# Altium project H_bridge_circut.PrjPcb
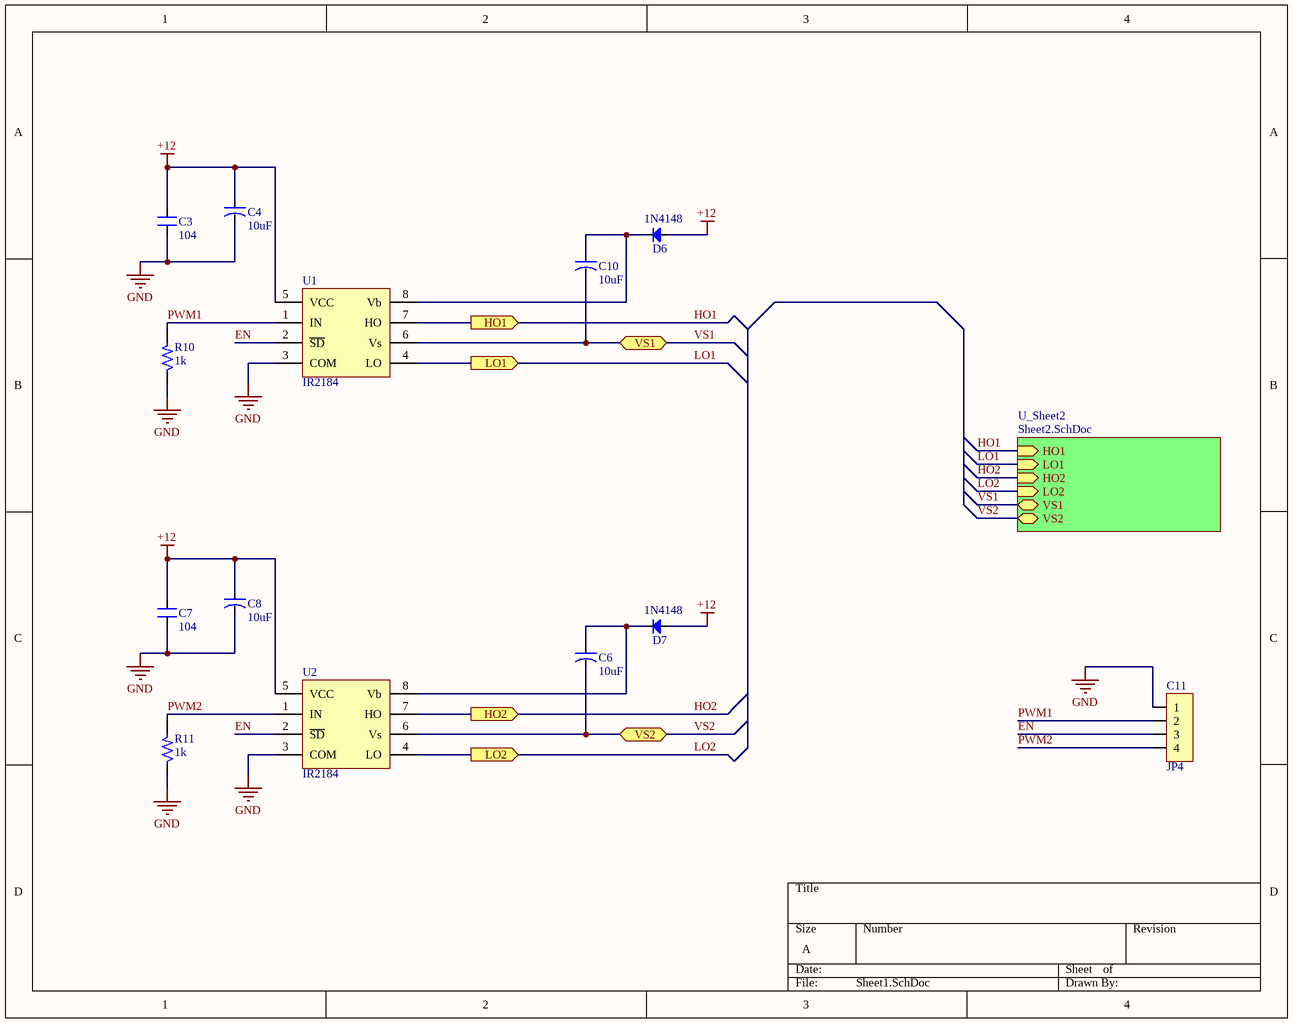
[diagram p0: Sheet1.SchDoc]
2 sheets, 40 parts. Net scope: hierarchical (ports join the sheet entries above them; power ports are global).
Board file: PCB1.PcbDoc
Sheets:
  Sheet1.SchDoc
    U_Sheet2 = Sheet2.SchDoc

## Sheet Sheet1.SchDoc
size A

### Parts
C3  104  [SM-CAP-0805]
C4  10uF  [CAP-ALU-SMD-4.5x5x1.4]
C6  10uF  [CAP-ALU-SMD-4.5x5x1.4]
C7  104  [SM-CAP-0805]
C8  10uF  [CAP-ALU-SMD-4.5x5x1.4]
C10  10uF  [CAP-ALU-SMD-4.5x5x1.4]
C11  JP4  [JP4-C1T]
D6  1N4148  [DIO-SMD-106]
D7  1N4148  [DIO-SMD-106]
R10  1k  [SM-RES-1206]
R11  1k  [SM-RES-1206]
U1  IR2184  [SO8]
U2  IR2184  [SO8]

### Sub-sheets
U_Sheet2 = Sheet2.SchDoc: HO1 (in), LO1 (in), HO2 (in), LO2 (in), VS1 (bidir), VS2 (bidir)

### Ports
HO1 (out), HO2 (out), LO1 (out), LO2 (out), VS1 (bidir), VS2 (bidir)

### Nets
+12: C3.2 C4.1 C7.2 C8.1 D6.1(A) D7.1(A) U1.5(VCC) U2.5(VCC)
GND: C3.1 C4.2 C7.1 C8.2 C11.1 R10.1 R11.1 U1.3(COM) U2.3(COM)
EN: C11.3 U1.2(~{SD}) U2.2(~{SD})
HO1: U1.7(HO) ; port HO1, sheet U_Sheet2/HO1
HO2: U2.7(HO) ; port HO2, sheet U_Sheet2/HO2
LO1: U1.4(LO) ; port LO1, sheet U_Sheet2/LO1
LO2: U2.4(LO) ; port LO2, sheet U_Sheet2/LO2
PWM1: C11.2 R10.2 U1.1(IN)
PWM2: C11.4 R11.2 U2.1(IN)
VS1: C10.2 U1.6(Vs) ; port VS1, sheet U_Sheet2/VS1
VS2: C6.2 U2.6(Vs) ; port VS2, sheet U_Sheet2/VS2
NetC6_1: C6.1 D7.2(K) U2.8(Vb)
NetC10_1: C10.1 D6.2(K) U1.8(Vb)

### Library data of the parts
C3 C7 = CN: Value: 0,1uF/300V; Designed by: VanDungEvn
C4 C6 C8 C10 = CN-ALU-SMD: Polarized Capacitor (Axial); Published: 8-Jun-2000; LatestRevisionDate: 17-Jul-2002; LatestRevisionNote: Re-released for DXP Platform.; PackageReference: POLAR0.8; Publisher: Altium Limited
C11 = JP4: WR-PHD 2.54 mm Angled Socket Header; Manufacturer: W¨¹rth Elektronik eiSos GmbH; partNo: 613004143121; ComponentLink1 Description: Manufacturer; ComponentLink2 Description: Datasheet; NoPins: 04; Created Date: 29 March 2013; ComponentLink1URL: http://www.we-online.com; ComponentLink2URL: http://katalog.we-online.de/em/datasheet/6130xx143121.pdf; Created by: Karrer Zheng
D6 D7 = Diode SMD: Default Diode; Code - JEDEC: DO-214-AB; Value: 1N5007; Published: 8-Jun-2000; Revision: July-2002: Re-released for DXP Platform.; Publisher: Altium Limited
R10 R11 = R: Resistor 1/4W; Value: R1/4W - 1K
U1 U2 = IR2184: Half-Bridge Driver

## Sheet Sheet2.SchDoc
size A
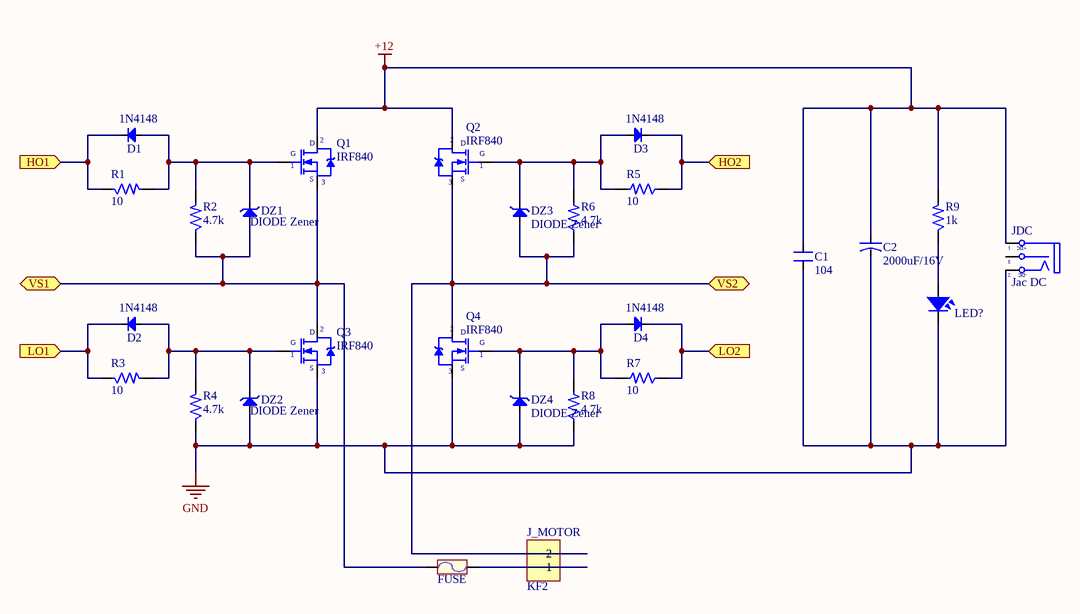
[diagram p1: Sheet2.SchDoc]

### Parts
C1  104  [SM-CAP-0805]
C2  2000uF/16V  [CA-ALU-2.54]
D1  1N4148  [DIO-SMD-106]
D2  1N4148  [DIO-SMD-106]
D3  1N4148  [DIO-SMD-106]
D4  1N4148  [DIO-SMD-106]
DZ1  DIODE Zener  [DIO-1A]
DZ2  DIODE Zener  [DIO-1A]
DZ3  DIODE Zener  [DIO-1A]
DZ4  DIODE Zener  [DIO-1A]
FUSE  F1A  [Fuse]  (value not drawn)
J_MOTOR  KF2  [KF2-3.5]
JDC  Jac DC  [DC-IN]
POWER_LED  LED SMD  [SM-LED-0805-Blue]  (value not drawn)
Q1  IRF840  [TO220-123]
Q2  IRF840  [TO220-123]
Q3  IRF840  [TO220-123]
Q4  IRF840  [TO220-123]
R1  10  [SM-RES-1206]
R2  4.7k  [SM-RES-1206]
R3  10  [SM-RES-1206]
R4  4.7k  [SM-RES-1206]
R5  10  [SM-RES-1206]
R6  4.7k  [SM-RES-1206]
R7  10  [SM-RES-1206]
R8  4.7k  [SM-RES-1206]
R9  1k  [SM-RES-1206]

### Ports
HO1 (in), HO2 (in), LO1 (in), LO2 (in), VS1 (bidir), VS2 (bidir)

### Nets
+12: C1.2 C2.1 JDC.1(T) Q1.2(D) Q2.2(D) R9.2
GND: C1.1 C2.2 DZ2.1(A) DZ4.1(A) JDC.2(TN) POWER_LED.2 Q3.3(S) Q4.3(S) R4.1 R8.1
HO1: D1.2(K) R1.1 ; port HO1
HO2: D3.2(K) R5.1 ; port HO2
LO1: D2.2(K) R3.1 ; port LO1
LO2: D4.2(K) R7.1 ; port LO2
VS1: DZ1.1(A) FUSE.1 Q1.3(S) Q3.2(D) R2.1 ; port VS1
VS2: DZ3.1(A) J_MOTOR.2 Q2.3(S) Q4.2(D) R6.1 ; port VS2
NetD1_1: D1.1(A) DZ1.2(K) Q1.1(G) R1.2 R2.2
NetD2_1: D2.1(A) DZ2.2(K) Q3.1(G) R3.2 R4.2
NetD3_1: D3.1(A) DZ3.2(K) Q2.1(G) R5.2 R6.2
NetD4_1: D4.1(A) DZ4.2(K) Q4.1(G) R7.2 R8.2
NetFUSE_2: FUSE.2 J_MOTOR.1
NetPOWER_LED_1: POWER_LED.1 R9.1

Not connected (* = marked no-connect by the designer): JDC 3(S)

### Notes on the sheet
- (in symbol DCIN) +DC; -DC

### Library data of the parts
C1 = CN: as C3 on sheet Sheet1
C2 = CN-ALU-DIP: Capacitor (Semiconductor SIM Model); Value: 104; LatestRevisionDate: 17-Jul-2002; LatestRevisionNote: Re-released for DXP Platform.; PackageReference: C1206; Publisher: Altium Limited
D1-D4 = Diode SMD: as D6 on sheet Sheet1; Published: 8-Jun-2000; Revision: July-2002: Re-released for DXP Platform.; Publisher: Altium Limited
DZ1-DZ4 = DIODE Zener: Zenner
FUSE = Fuse: Designed by: VanDungEvn; Value: Fuse
J_MOTOR = KF2: Manufacturer: Würth Elektronik eiSos GmbH; partNo: 691103110002; ComponentLink1 Description: Manufacturer; ComponentLink2 Description: Datasheet; NoPins: 2; Created Date: 29 October 2013; ComponentLink1URL: http://www.we-online.com; ComponentLink2URL: http://katalog.we-online.de/em/datasheet/6911031100xx.pdf; Created by: Karrer Zheng
JDC = DCIN: Jac DC input; Value: Jac DC
POWER_LED = LED-SMD-0805
Q1-Q4 = IRF840: MOSFET N - CHANNEL 500V - 0.75 - 8A - TO-220; Value: IRF840
R1-R9 = R: Resistor 1/4W; Value: R1/4W - 1K

## Nets that join several sheets
+12: Sheet1 (8 pins), Sheet2 (6 pins)
GND: Sheet1 (9 pins), Sheet2 (10 pins)
HO1: Sheet1 (U1.7), Sheet2 (D1.2 R1.1)
HO2: Sheet1 (U2.7), Sheet2 (D3.2 R5.1)
LO1: Sheet1 (U1.4), Sheet2 (D2.2 R3.1)
LO2: Sheet1 (U2.4), Sheet2 (D4.2 R7.1)
VS1: Sheet1 (C10.2 U1.6), Sheet2 (5 pins)
VS2: Sheet1 (C6.2 U2.6), Sheet2 (5 pins)